# Altium schematic sheet led_VDC.SchDoc
size A; SheetNumber: 12; SheetTotal: 12; SPICEModelCacheQAAZNQEN: <root> / <DocumentId>QAAZNQEN</DocumentId> / <CacheFrame Number="0"> / <Model Name="led0" Kind="MDL"> / <Text>*Typ INFRARED GaAs LED: Vf=1.2V Vr=5V If=40mA trr=3uS / *LED Pinout: 1=A, 2=K / .MODEL LED0 D (IS=93.5P RS=84M N=2.63 BV=5 IBV=10U / + CJO=2.97P VJ=.75 M=.333 TT=4.32U)</Text> / </Model> / </CacheFrame> / </root>
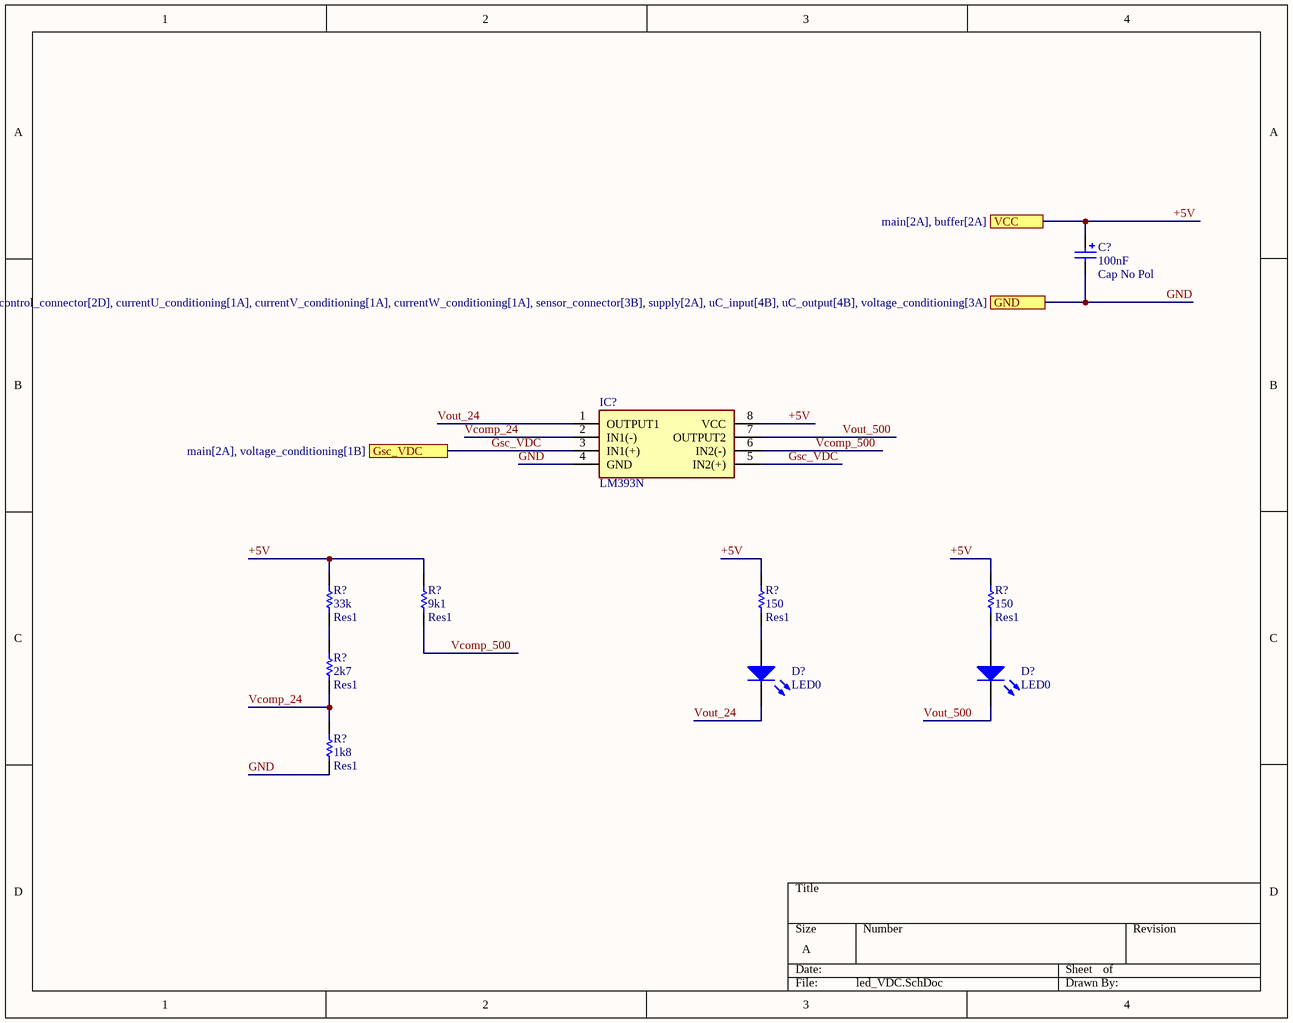
[diagram p0: led_VDC.SchDoc]

## Parts
(Parts that share a designator on the sheet are numbered #1, #2 ... from top to bottom, then left to right.)
C?  Cap No Pol  value 100nF  [RAD-0.1]
D?#1  LED0  [LED-0]
D?#2  LED0  [LED-0]
IC?  LM393N  [DIP787W53P254L980H533Q8N]
R?#1  Res1  value 33k  [AXIAL-0.3]
R?#2  Res1  value 9k1  [AXIAL-0.3]
R?#3  Res1  value 150  [AXIAL-0.3]
R?#4  Res1  value 150  [AXIAL-0.3]
R?#5  Res1  value 2k7  [AXIAL-0.3]
R?#6  Res1  value 1k8  [AXIAL-0.3]

## Ports
GND (see main[3A], buffer[2A], control_connector[2D], currentU_conditioning[1A], currentV_conditioning[1A], currentW_conditioning[1A], sensor_connector[3B], supply[2A], uC_input[4B], uC_output[4B], voltage_conditioning[3A]), Gsc_VDC (see main[2A], voltage_conditioning[1B]), VCC (see main[2A], buffer[2A])

## Nets
+5V: C?.1 IC?.8(VCC) R?#1.2 R?#2.2 R?#3.2 R?#4.2 ; port VCC
GND: C?.2 IC?.4(GND) R?#6.1 ; port GND
Gsc_VDC: IC?.3(IN1(+)) IC?.5(IN2(+)) ; port Gsc_VDC
Vcomp_24: IC?.2(IN1(-)) R?#5.1 R?#6.2
Vcomp_500: IC?.6(IN2(-)) R?#2.1
Vout_24: D?#1.2(K) IC?.1(OUTPUT1)
Vout_500: D?#2.2(K) IC?.7(OUTPUT2)
NetD?#1_1: D?#1.1(A) R?#3.1
NetD?#2_1: D?#2.1(A) R?#4.1
NetR?#1_1: R?#1.1 R?#5.2

## Library data of the parts
C? = Cap No Pol: Polarized Capacitor (Radial); Published: 8-Jun-2000; LatestRevisionDate: 17-Jul-2002; LatestRevisionNote: Re-released for DXP Platform.; PackageReference: RB7.6-15; Publisher: Altium Limited; PackageDescription: Polarized Capacitor (Radial); 2 Leads
D?#1 D?#2 = LED0: Typical INFRARED GaAs LED; Published: 8-Jun-2000; LatestRevisionDate: 08-Jul-2005; LatestRevisionNote: Mech Layer 1 removed.; PackageReference: LED-0; Publisher: Altium Limited; PackageDescription: LED; 2 Leads
IC? = LM393N: Integrated Circuit; Manufacturer_Name: Texas Instruments; Datasheet Link: https://datasheet.datasheetarchive.com/originals/distributors/Datasheets-SFU2/DSASFU100036444.pdf; Height: 5.33mm; Manufacturer_Part_Number: LM393N; Mouser Part Number: 926-LM393N; Mouser Price/Stock: https://www.mouser.co.uk/ProductDetail/Texas-Instruments/LM393N?qs=QbsRYf82W3HvgSG%252BWhL68w%3D%3D
R?#1-R?#6 = Res1: Resistor; Published: 8-Jun-2000; LatestRevisionDate: 17-Jul-2002; LatestRevisionNote: Re-released for DXP Platform.; PackageReference: AXIAL-0.3; Publisher: Altium Limited; PackageDescription: Axial Device, Thru-Hole; 2 Leads; 0.3 in Pin Spacing